# EAGLE design input (EAGLE 6.2)
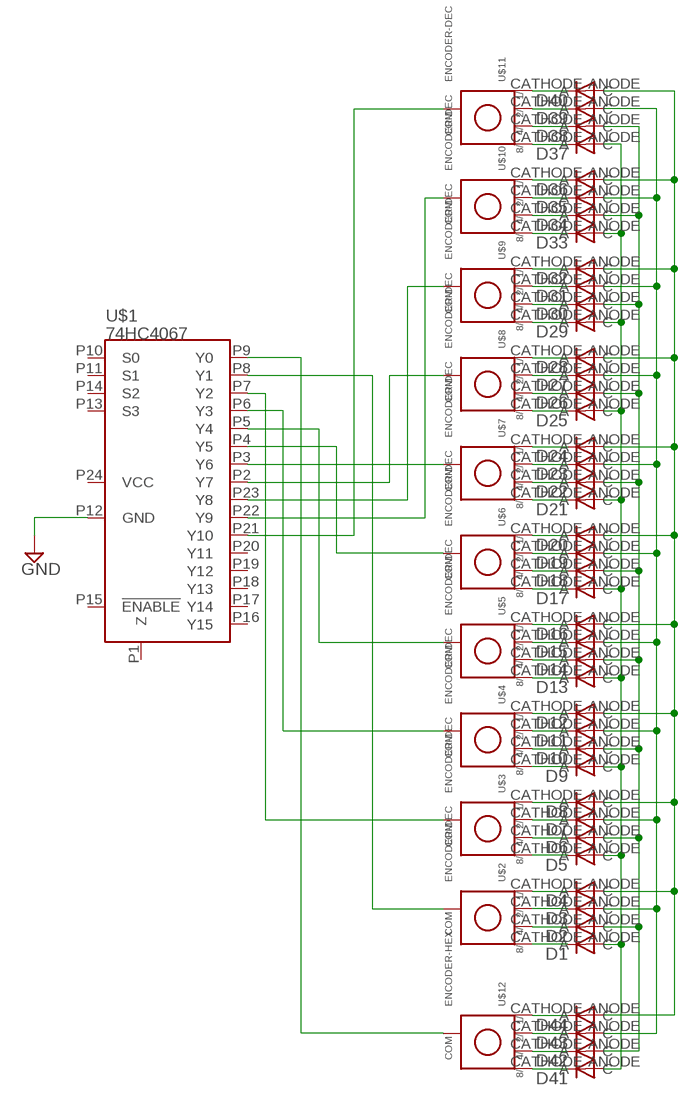
[diagram p0: schematic, sheet 1]

## Parts
D1  TS4148  [0805]
D2  TS4148  [0805]
D3  TS4148  [0805]
D4  TS4148  [0805]
D5  TS4148  [0805]
D6  TS4148  [0805]
D7  TS4148  [0805]
D8  TS4148  [0805]
D9  TS4148  [0805]
D10  TS4148  [0805]
D11  TS4148  [0805]
D12  TS4148  [0805]
D13  TS4148  [0805]
D14  TS4148  [0805]
D15  TS4148  [0805]
D16  TS4148  [0805]
D17  TS4148  [0805]
D18  TS4148  [0805]
D19  TS4148  [0805]
D20  TS4148  [0805]
D21  TS4148  [0805]
D22  TS4148  [0805]
D23  TS4148  [0805]
D24  TS4148  [0805]
D25  TS4148  [0805]
D26  TS4148  [0805]
D27  TS4148  [0805]
D28  TS4148  [0805]
D29  TS4148  [0805]
D30  TS4148  [0805]
D31  TS4148  [0805]
D32  TS4148  [0805]
D33  TS4148  [0805]
D34  TS4148  [0805]
D35  TS4148  [0805]
D36  TS4148  [0805]
D37  TS4148  [0805]
D38  TS4148  [0805]
D39  TS4148  [0805]
D40  TS4148  [0805]
D41  TS4148  [0805]
D42  TS4148  [0805]
D43  TS4148  [0805]
D44  TS4148  [0805]
U$1  74HC4067  [DIP-24]
U$2  ENCODER-DEC  [4-BIT-ENCODER]
U$3  ENCODER-DEC  [4-BIT-ENCODER]
U$4  ENCODER-DEC  [4-BIT-ENCODER]
U$5  ENCODER-DEC  [4-BIT-ENCODER]
U$6  ENCODER-DEC  [4-BIT-ENCODER]
U$7  ENCODER-DEC  [4-BIT-ENCODER]
U$8  ENCODER-DEC  [4-BIT-ENCODER]
U$9  ENCODER-DEC  [4-BIT-ENCODER]
U$10  ENCODER-DEC  [4-BIT-ENCODER]
U$11  ENCODER-DEC  [4-BIT-ENCODER]
U$12  ENCODER-HEX  [4-BIT-ENCODER]

## Nets
GND: U$1.P12(GND)
N$1: D1.CATHODE(C) U$2.8/
N$2: D2.CATHODE(C) U$2.4/
N$3: D3.CATHODE(C) U$2.2/
N$4: D4.CATHODE(C) U$2.1/
N$5: D5.CATHODE(C) U$3.8/
N$6: D6.CATHODE(C) U$3.4/
N$7: D7.CATHODE(C) U$3.2/
N$8: D8.CATHODE(C) U$3.1/
N$9: D9.CATHODE(C) U$4.8/
N$10: D10.CATHODE(C) U$4.4/
N$11: D11.CATHODE(C) U$4.2/
N$12: D12.CATHODE(C) U$4.1/
N$13: D13.CATHODE(C) U$5.8/
N$14: D14.CATHODE(C) U$5.4/
N$15: D15.CATHODE(C) U$5.2/
N$16: D16.CATHODE(C) U$5.1/
N$17: D17.CATHODE(C) U$6.8/
N$18: D18.CATHODE(C) U$6.4/
N$19: D19.CATHODE(C) U$6.2/
N$20: D20.CATHODE(C) U$6.1/
N$21: D21.CATHODE(C) U$7.8/
N$22: D22.CATHODE(C) U$7.4/
N$23: D23.CATHODE(C) U$7.2/
N$24: D24.CATHODE(C) U$7.1/
N$25: D25.CATHODE(C) U$8.8/
N$26: D26.CATHODE(C) U$8.4/
N$27: D27.CATHODE(C) U$8.2/
N$28: D28.CATHODE(C) U$8.1/
N$29: D29.CATHODE(C) U$9.8/
N$30: D30.CATHODE(C) U$9.4/
N$31: D31.CATHODE(C) U$9.2/
N$32: D32.CATHODE(C) U$9.1/
N$33: D33.CATHODE(C) U$10.8/
N$34: D34.CATHODE(C) U$10.4/
N$35: D35.CATHODE(C) U$10.2/
N$36: D36.CATHODE(C) U$10.1/
N$37: D37.CATHODE(C) U$11.8/
N$38: D38.CATHODE(C) U$11.4/
N$39: D39.CATHODE(C) U$11.2/
N$40: D40.CATHODE(C) U$11.1/
N$41: D41.CATHODE(C) U$12.8/
N$42: D42.CATHODE(C) U$12.4/
N$43: D43.CATHODE(C) U$12.2/
N$44: D44.CATHODE(C) U$12.1/
N$45: D1.ANODE(A) D5.ANODE(A) D9.ANODE(A) D13.ANODE(A) D17.ANODE(A) D21.ANODE(A) D25.ANODE(A) D29.ANODE(A) D33.ANODE(A) D37.ANODE(A) D41.ANODE(A)
N$46: D2.ANODE(A) D6.ANODE(A) D10.ANODE(A) D14.ANODE(A) D18.ANODE(A) D22.ANODE(A) D26.ANODE(A) D30.ANODE(A) D34.ANODE(A) D38.ANODE(A) D42.ANODE(A)
N$47: D3.ANODE(A) D7.ANODE(A) D11.ANODE(A) D15.ANODE(A) D19.ANODE(A) D23.ANODE(A) D27.ANODE(A) D31.ANODE(A) D35.ANODE(A) D39.ANODE(A) D43.ANODE(A)
N$48: D4.ANODE(A) D8.ANODE(A) D12.ANODE(A) D16.ANODE(A) D20.ANODE(A) D24.ANODE(A) D28.ANODE(A) D32.ANODE(A) D36.ANODE(A) D40.ANODE(A) D44.ANODE(A)
N$49: U$1.P8(Y1) U$2.COMMON
N$50: U$1.P7(Y2) U$3.COMMON
N$51: U$1.P6(Y3) U$4.COMMON
N$52: U$1.P4(Y5) U$6.COMMON
N$53: U$1.P3(Y6) U$7.COMMON
N$54: U$1.P2(Y7) U$8.COMMON
N$55: U$1.P9(Y0) U$12.COMMON
N$56: U$1.P23(Y8) U$9.COMMON
N$57: U$1.P22(Y9) U$10.COMMON
N$58: U$1.P5(Y4) U$5.COMMON
N$59: U$1.P21(Y10) U$11.COMMON
Unconnected: U$1.P1(Z) U$1.P10(S0) U$1.P11(S1) U$1.P13(S3) U$1.P14(S2) U$1.P15(!ENABLE!) U$1.P16(Y15) U$1.P17(Y14) U$1.P18(Y13) U$1.P19(Y12) U$1.P20(Y11)

## Power pins joined to a net without a drawn wire
VCC: U$1.P24(VCC)

## Library data of the parts
D1-D44 = monitor-parts:TS4148
U$1 = monitor-parts:74HC4067
U$2-U$11 = monitor-parts:ENCODER-DEC
U$12 = monitor-parts:ENCODER-HEX

## Board
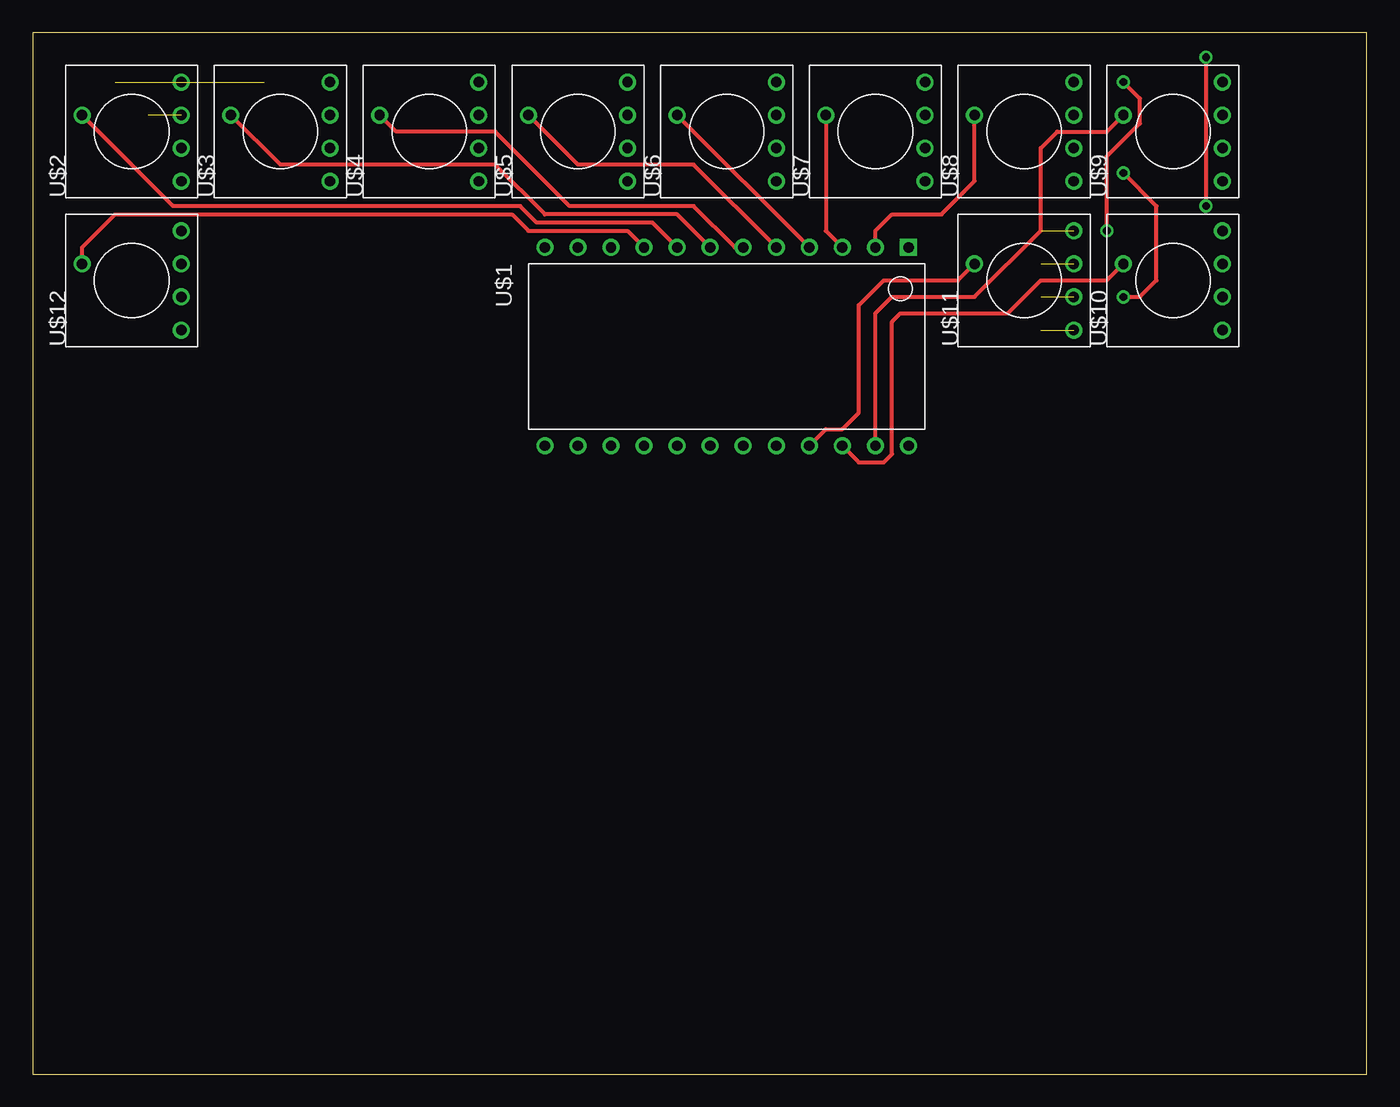
[diagram p1: board, top side]
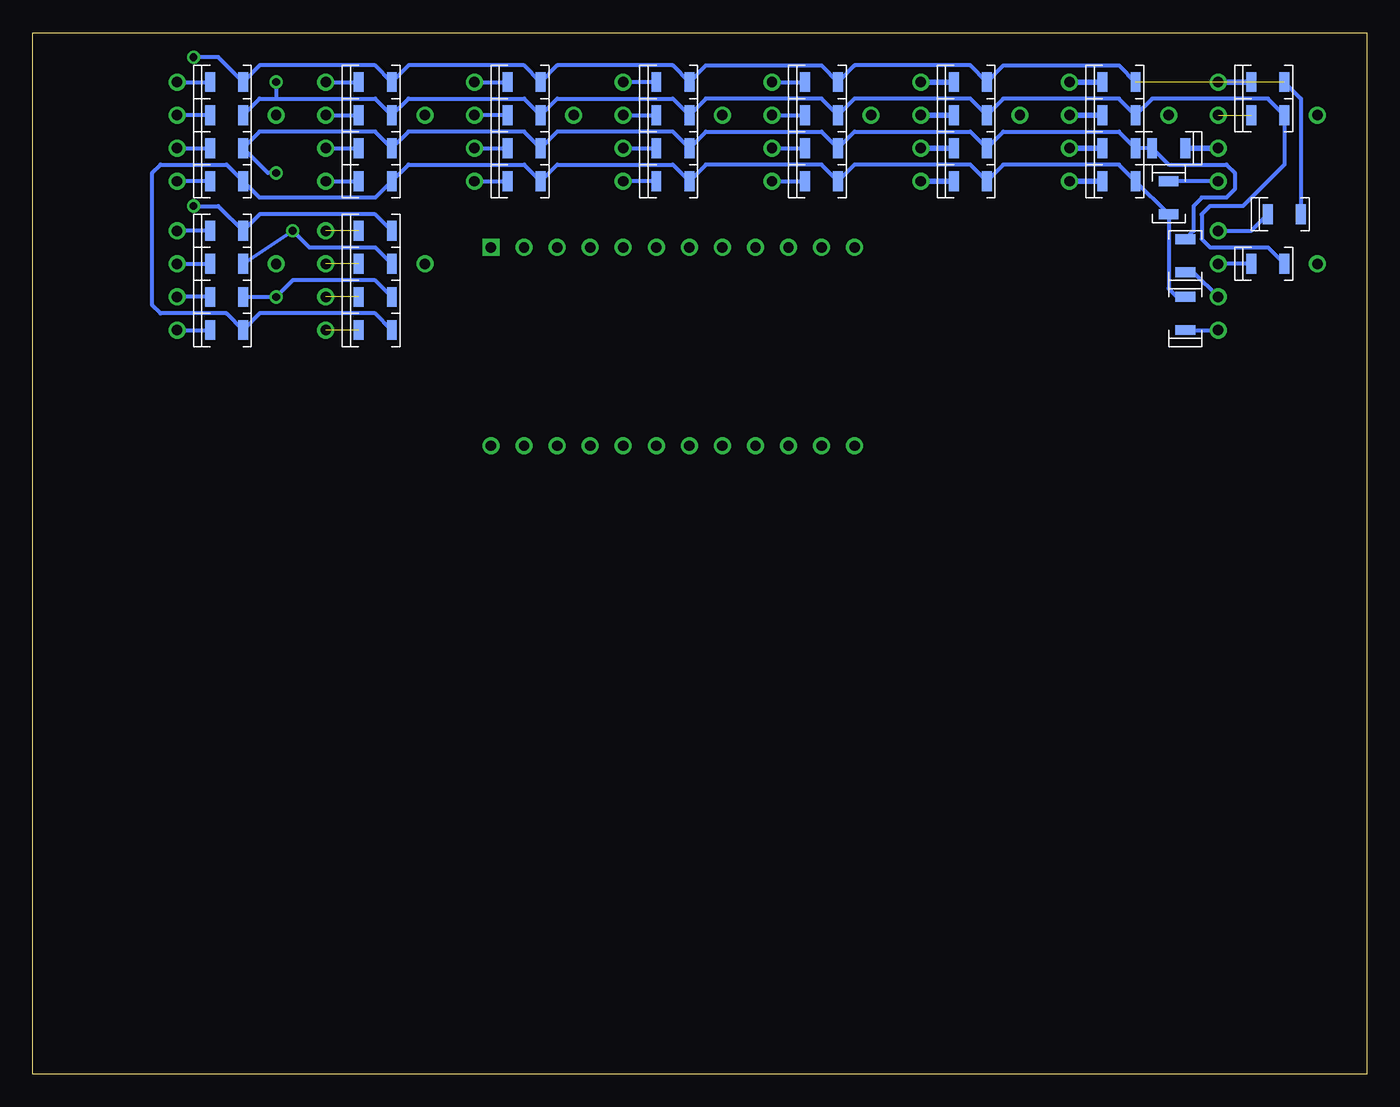
[diagram p2: board, bottom side, seen from below]

Size 102.54 x 80 mm. Coordinates in mm from the lower left corner, seen from the top.
Outline: 0,0 102.54,0 102.54,80 0,80 0,0
Copper layers (1*16): Top 0.035mm / dielectric 1.5mm / Bottom 0.035mm
Design rules: minimum track width 10mil, minimum drill 24mil, track to track 8mil, track to pad 8mil, pad to pad 8mil, via to via 8mil, smd to smd 8mil, copper to edge 40mil, drill to drill 8mil, minimum pad ring 10mil, minimum via ring 8mil, stop-mask expansion 4mil, vias tented up to drill 0mil, thermal gap 10mil

### Footprints (pad centres in the part's own frame; a part is rotated, then mirrored left to right if it is on the bottom)
0805 = smd 0.762 x 1.524: ANODE 2.54,0; CATHODE 0,0
DIP-24 = drill 0.8 square: P1 -7.62,13.97 | drill 0.8: P2 -7.62,11.43; P3 -7.62,8.89; P4 -7.62,6.35; P5 -7.62,3.81; P6 -7.62,1.27; P7 -7.62,-1.27; P8 -7.62,-3.81; P9 -7.62,-6.35; P10 -7.62,-8.89; P11 -7.62,-11.43; P12 -7.62,-13.97; P13 7.62,-13.97; P14 7.62,-11.43; P15 7.62,-8.89; P16 7.62,-6.35; P17 7.62,-3.81; P18 7.62,-1.27; P19 7.62,1.27; P20 7.62,3.81; P21 7.62,6.35; P22 7.62,8.89; P23 7.62,11.43; P24 7.62,13.97
4-BIT-ENCODER = drill 0.8: 1/ 3.81,-3.81; 2/ 1.27,-3.81; 4/ -1.27,-3.81; 8/ -3.81,-3.81; COMMON 1.27,3.81

### Placement (x,y rotation side)
D1  15.24,68.58 270 bottom
D2  13.97,71.12 180 bottom
D3  8.89,73.66 0 bottom
D4  8.89,76.2 0 bottom
D5  20.32,68.58 0 bottom
D6  20.32,71.12 0 bottom
D7  20.32,73.66 0 bottom
D8  20.32,76.2 0 bottom
D9  31.75,68.58 0 bottom
D10  31.75,71.12 0 bottom
D11  31.75,73.66 0 bottom
D12  31.75,76.2 0 bottom
D13  43.18,68.58 0 bottom
D14  43.18,71.12 0 bottom
D15  43.18,73.66 0 bottom
D16  43.18,76.2 0 bottom
D17  54.61,68.58 0 bottom
D18  54.61,71.12 0 bottom
D19  54.61,73.66 0 bottom
D20  54.61,76.2 0 bottom
D21  66.04,68.58 0 bottom
D22  66.04,71.12 0 bottom
D23  66.04,73.66 0 bottom
D24  66.04,76.2 0 bottom
D25  77.47,68.58 0 bottom
D26  77.47,71.12 0 bottom
D27  77.47,73.66 0 bottom
D28  77.47,76.2 0 bottom
D29  88.9,68.58 0 bottom
D30  88.9,71.12 0 bottom
D31  88.9,73.66 0 bottom
D32  88.9,76.2 0 bottom
D33  88.9,57.15 0 bottom
D34  88.9,59.69 0 bottom
D35  88.9,62.23 0 bottom
D36  88.9,64.77 0 bottom
D37  77.47,57.15 0 bottom
D38  77.47,59.69 0 bottom
D39  77.47,62.23 0 bottom
D40  77.47,64.77 0 bottom
D41  13.97,57.15 90 bottom
D42  13.97,61.59 90 bottom
D43  8.89,62.23 0 bottom
D44  7.62,66.04 0 bottom
U$1  53.34,55.88 270 top
U$2  7.62,72.39 90 top
U$3  19.05,72.39 90 top
U$4  30.48,72.39 90 top
U$5  41.91,72.39 90 top
U$6  53.34,72.39 90 top
U$7  64.77,72.39 90 top
U$8  76.2,72.39 90 top
U$9  87.63,72.39 90 top
U$10  87.63,60.96 90 top
U$11  76.2,60.96 90 top
U$12  7.62,60.96 90 top

### Tracks (layer width: path | path; a pad name or v marks a point on that pad's centre or on a via)
N$1
  Bottom 0.305: U$2.8/ D1.CATHODE
N$2
  Bottom 0.406: U$2.4/ D2.CATHODE
N$3  (1 unrouted)
N$4
  Bottom 0.406: U$2.1/ D4.CATHODE
N$5
  Bottom 0.406: U$3.8/ D5.CATHODE
N$6
  Bottom 0.406: U$3.4/ D6.CATHODE
N$7
  Bottom 0.406: U$3.2/ D7.CATHODE
N$8
  Bottom 0.406: U$3.1/ D8.CATHODE
N$9
  Bottom 0.406: U$4.8/ D9.CATHODE
N$10
  Bottom 0.406: U$4.4/ D10.CATHODE
N$11
  Bottom 0.406: U$4.2/ D11.CATHODE
N$12
  Bottom 0.406: U$4.1/ D12.CATHODE
N$13
  Bottom 0.305: U$5.8/ D13.CATHODE
N$14
  Bottom 0.305: U$5.4/ D14.CATHODE
N$15
  Bottom 0.305: U$5.2/ D15.CATHODE
N$16
  Bottom 0.305: U$5.1/ D16.CATHODE
N$17
  Bottom 0.305: D17.CATHODE U$6.8/
N$18
  Bottom 0.305: U$6.4/ D18.CATHODE
N$19
  Bottom 0.305: U$6.2/ D19.CATHODE
N$20
  Bottom 0.305: D20.CATHODE U$6.1/
N$21
  Bottom 0.305: U$7.8/ D21.CATHODE
N$22
  Bottom 0.305: U$7.4/ D22.CATHODE
N$23
  Bottom 0.305: D23.CATHODE U$7.2/
N$24
  Bottom 0.305: U$7.1/ D24.CATHODE
N$25
  Bottom 0.305: U$8.8/ D25.CATHODE
N$26
  Bottom 0.305: U$8.4/ D26.CATHODE
N$27
  Bottom 0.305: U$8.2/ D27.CATHODE
N$28
  Bottom 0.305: U$8.1/ D28.CATHODE
N$29
  Bottom 0.305: D29.CATHODE U$9.8/
N$30
  Bottom 0.305: U$9.4/ D30.CATHODE
N$31
  Bottom 0.305: D31.CATHODE U$9.2/
N$32
  Bottom 0.305: U$9.1/ D32.CATHODE
N$33
  Bottom 0.305: U$10.8/ D33.CATHODE
N$34
  Bottom 0.305: D34.CATHODE U$10.4/
N$35
  Bottom 0.305: U$10.2/ D35.CATHODE
N$36
  Bottom 0.305: D36.CATHODE U$10.1/
N$37  (1 unrouted)
N$38  (1 unrouted)
N$39  (1 unrouted)
N$40  (1 unrouted)
N$41
  Bottom 0.305: D41.CATHODE U$12.8/
N$42
  Bottom 0.305: D42.CATHODE 13.34,61.59 U$12.4/
N$43
  Bottom 0.305: D43.CATHODE U$12.2/
N$44
  Bottom 0.305: U$12.1/ 8.89,64.77 D44.CATHODE
N$45
  Bottom 0.305: D37.ANODE 76.2,58.42 85.09,58.42 D33.ANODE 87.63,58.42 92.71,58.42 93.34,59.05 93.34,69.22 92.71,69.85 87.63,69.85 D29.ANODE 85.09,67.31 76.2,67.31 D25.ANODE 73.66,69.85 64.77,69.85 D21.ANODE 62.23,69.85 53.34,69.85 D17.ANODE 50.8,69.85 41.91,69.85 D13.ANODE 39.37,69.85 30.48,69.85 D9.ANODE 27.94,69.85 19.05,69.85 D5.ANODE D1.ANODE 15.24,60.33 14.61,59.69 D41.ANODE
N$46  (via drill 0.6)
  Top 0.305: v83.82,59.69 85.09,59.69 86.36,60.96 86.36,66.67 v83.82,69.22
  Bottom 0.305: D34.ANODE v83.82,59.69 82.55,60.96 76.2,60.96 D38.ANODE | v83.82,69.22 84.45,69.22 D30.ANODE 85.09,72.39 76.2,72.39 D26.ANODE 73.66,72.39 64.77,72.39 D22.ANODE 62.23,72.39 53.34,72.39 D18.ANODE 50.8,72.39 41.91,72.39 D14.ANODE 39.37,72.39 30.48,72.39 D10.ANODE 27.94,72.39 19.05,72.39 D6.ANODE D2.ANODE 15.24,69.85 10.79,69.85 10.16,69.22 10.16,67.94 10.79,67.31 12.7,67.31 13.34,66.67 13.34,64.77 D42.ANODE
N$47  (via drill 0.6)
  Top 0.305: v82.55,64.77 82.55,70.48 85.09,73.03 85.09,74.93 v83.82,76.2
  Bottom 0.305: D31.ANODE 85.09,74.93 83.82,74.93 | 83.82,74.93 76.2,74.93 D27.ANODE 73.66,74.93 64.77,74.93 D23.ANODE 62.23,74.93 53.34,74.93 D19.ANODE 50.8,74.93 41.91,74.93 D15.ANODE 39.37,74.93 30.48,74.93 D11.ANODE 27.94,74.93 19.05,74.93 D7.ANODE 16.51,74.93 7.62,74.93 D3.ANODE 6.35,69.85 9.53,66.67 12.06,66.67 12.7,66.04 12.7,64.14 12.06,63.5 7.62,63.5 D43.ANODE | v83.82,76.2 83.82,74.93 | D35.ANODE v82.55,64.77 81.28,63.5 76.2,63.5 D39.ANODE
N$48  (via drill 0.6)  (1 unrouted)
  Top 0.305: v90.17,78.11 v90.17,66.67
  Bottom 0.305: D8.ANODE 19.05,77.47 27.94,77.47 D12.ANODE 30.48,77.47 39.37,77.47 D16.ANODE 41.91,77.47 50.8,77.47 D20.ANODE 53.34,77.47 62.23,77.47 D24.ANODE 64.77,77.47 73.66,77.47 D28.ANODE 76.2,77.47 85.09,77.47 D32.ANODE 88.27,78.11 v90.17,78.11 | v90.17,66.67 88.27,66.67 D36.ANODE 85.09,66.04 76.2,66.04 D40.ANODE | D4.ANODE 5.08,74.93 D44.ANODE
N$49
  Top 0.305: U$1.P8 47.62,65.41 38.73,65.41 37.47,66.67 10.79,66.67 U$2.COMMON
N$50
  Top 0.305: U$1.P7 49.53,66.04 39.37,66.04 35.56,69.85 19.05,69.85 U$3.COMMON
N$51
  Top 0.305: U$1.P6 53.98,63.5 50.8,66.67 41.27,66.67 35.56,72.39 27.94,72.39 U$4.COMMON
N$52
  Top 0.305: U$6.COMMON U$1.P4
N$53
  Top 0.305: U$7.COMMON 60.96,64.77 U$1.P3
N$54
  Top 0.305: U$1.P2 64.77,64.77 66.04,66.04 69.85,66.04 72.39,68.58 U$8.COMMON
N$55
  Top 0.305: U$12.COMMON 3.81,63.5 6.35,66.04 36.83,66.04 38.1,64.77 45.72,64.77 U$1.P9
N$56
  Top 0.305: U$1.P23 64.77,58.42 66.04,59.69 72.39,59.69 77.47,64.77 77.47,71.12 78.74,72.39 82.55,72.39 U$9.COMMON
N$57
  Top 0.305: U$1.P22 63.5,46.99 65.41,46.99 66.04,47.62 66.04,57.78 66.67,58.42 74.93,58.42 77.47,60.96 82.55,60.96 U$10.COMMON
N$58
  Top 0.305: U$1.P5 50.8,69.85 41.91,69.85 U$5.COMMON
N$59
  Top 0.305: U$1.P21 60.96,49.53 62.23,49.53 63.5,50.8 63.5,59.05 65.41,60.96 71.12,60.96 U$11.COMMON